# EAGLE schematic mobo-dual-boards (EAGLE 6.6.0)
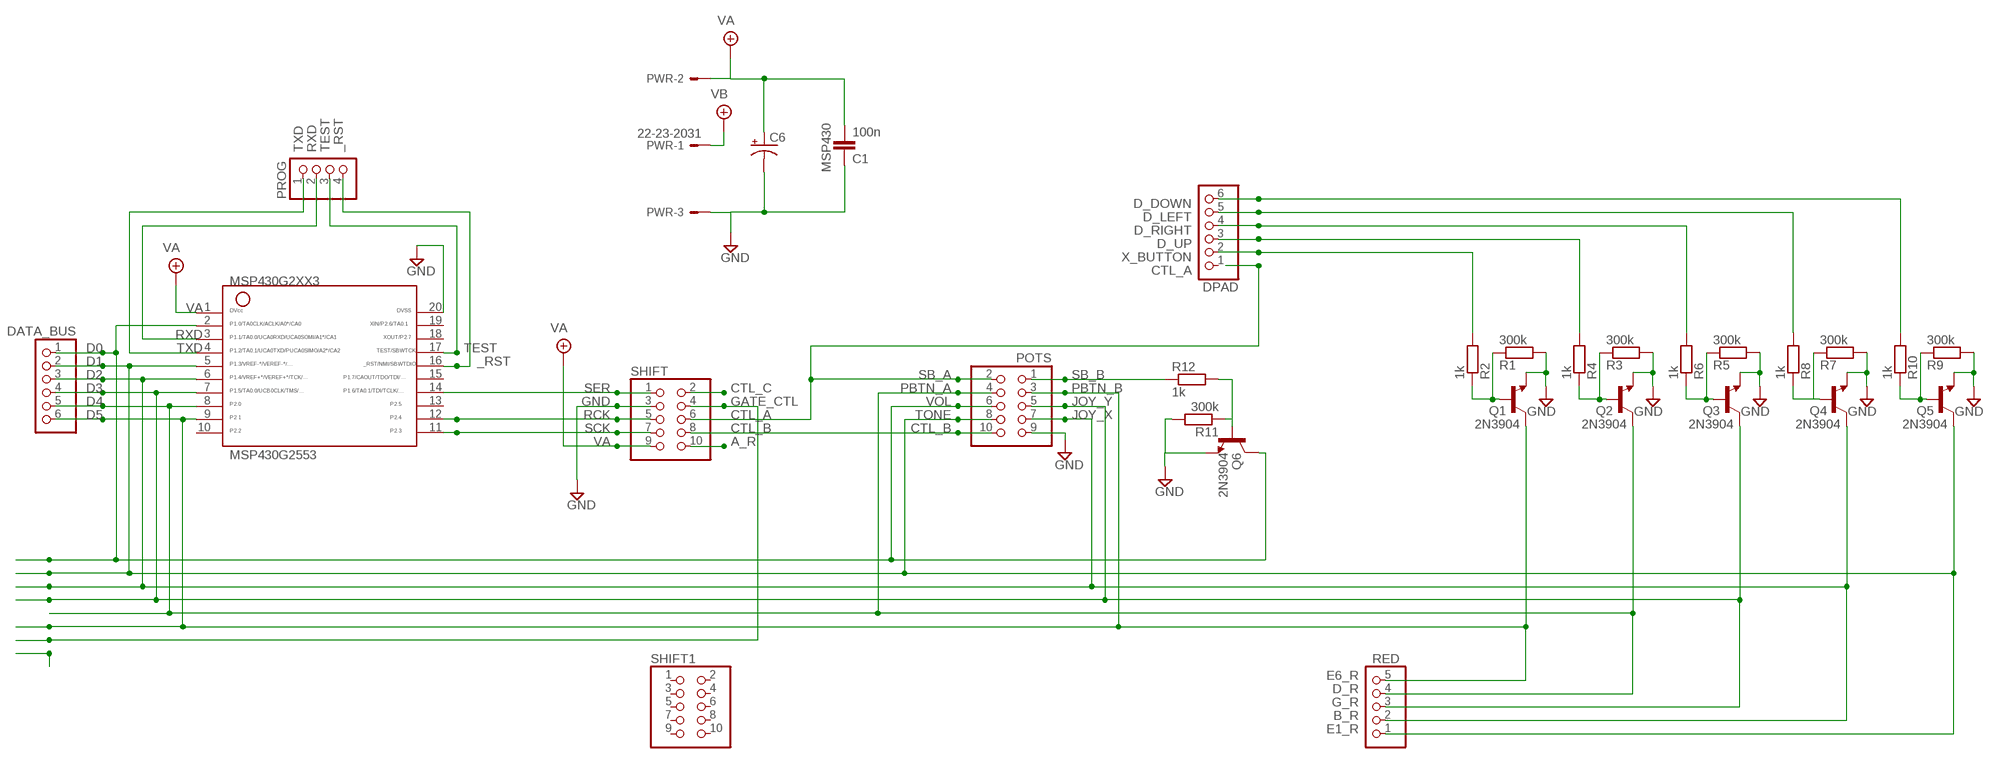
[diagram p0: schematic, sheet 1]

## Parts
C1  100n  050X030_050  [050X030_050_3]
C6  0501  [050_020_1]
DATA_BUS  PINHD-1X6  [1X06]
DPAD  PINHD-1X6  [1X06]
MSP430G2553  G2XX3---N20  [N20]
POTS  PINHD-2X5  [2X05]
PROG  PINHD-1X4  [1X04]
PWR  22-23-2031  [22-23-2031]
Q1  2N3904  [TO92-]
Q2  2N3904  [TO92-]
Q3  2N3904  [TO92-]
Q4  2N3904  [TO92-]
Q5  2N3904  [TO92-]
Q6  2N3904  [TO92-]
R1  300k  6MM-EU1  [R0207/1V]
R2  1k  6MM-EU1  [R0207/1V]
R3  300k  6MM-EU1  [R0207/1V]
R4  1k  6MM-EU1  [R0207/1V]
R5  300k  6MM-EU1  [R0207/1V]
R6  1k  6MM-EU1  [R0207/1V]
R7  300k  6MM-EU1  [R0207/1V]
R8  1k  6MM-EU1  [R0207/1V]
R9  300k  6MM-EU1  [R0207/1V]
R10  1k  6MM-EU1  [R0207/1V]
R11  300k  6MM-EU1  [R0207/1V]
R12  1k  6MM-EU1  [R0207/1V]
RED  PINHD-1X5  [1X05]
SHIFT  PINHD-2X5  [2X05]
SHIFT1  PINHD-2X5  [2X05]

## Nets
_RST: MSP430G2553.16 PROG.4
CTL_A: POTS.2 SHIFT.6
CTL_B: POTS.10 SHIFT.8
CTL_C: SHIFT.2
D0: DATA_BUS.1 MSP430G2553.2 POTS.6 Q6.1(C) SHIFT.10
D1: DATA_BUS.2 MSP430G2553.5 POTS.8 Q5.1(C) RED.1
D2: DATA_BUS.3 MSP430G2553.6 POTS.7 Q4.1(C) RED.2
D3: DATA_BUS.4 MSP430G2553.7 POTS.5 Q3.1(C) RED.3
D4: DATA_BUS.5 MSP430G2553.8 POTS.4 Q2.1(C) RED.4
D5: DATA_BUS.6 MSP430G2553.9 POTS.3 Q1.1(C) RED.5
D_DOWN: DPAD.6 R10.2
D_LEFT: DPAD.5 R8.2
D_RIGHT: DPAD.4 R6.2
D_UP: DPAD.3 R4.2
GATE_CTL: SHIFT.4
GND: C1.1 C6.- MSP430G2553.20 POTS.9 PWR.3 Q1.3(E) Q2.3(E) Q3.3(E) Q4.3(E) Q5.3(E) Q6.3(E) R1.2 R3.2 R5.2 R7.2 R9.2 R11.2 SHIFT.3
N$1: Q6.2(B) R11.1 R12.2
N$13: Q1.2(B) R1.1 R2.1
N$14: Q2.2(B) R3.1 R4.1
N$15: Q3.2(B) R5.1 R6.1
N$16: Q4.2(B) R7.1 R8.1
N$17: Q5.2(B) R9.1 R10.1
N$27: POTS.1 R12.1
RCK: MSP430G2553.12 SHIFT.5
RXD: MSP430G2553.3 PROG.2
SCK: MSP430G2553.11 SHIFT.7
SER: MSP430G2553.14 SHIFT.1
TEST: MSP430G2553.17 PROG.3
TXD: MSP430G2553.4 PROG.1
VA: C1.2 C6.+ MSP430G2553.1 PWR.2 SHIFT.9
VB: PWR.1
X_BUTTON: DPAD.2 R2.2
Unconnected: DPAD.1 MSP430G2553.10 MSP430G2553.13 MSP430G2553.15 MSP430G2553.18 MSP430G2553.19 SHIFT1.1 SHIFT1.2 SHIFT1.3 SHIFT1.4 SHIFT1.5 SHIFT1.6 SHIFT1.7 SHIFT1.8 SHIFT1.9 SHIFT1.10

## Notes on the sheet
- MSP430
- CTL_A
- SB_A | SB_B
- PBTN_A | PBTN_B
- VOL | JOY_Y
- TONE | JOY_X
- CTL_B
- A_R
- E6_R
- D_R
- G_R
- B_R
- E1_R

## Library data of the parts
C1 = gm-caps-ceramic:050X030_050: 120 - 150pF Xicon Ceramic Disc 5mm lead spacing
C6 = gm-caps-electro-pol:050: 0.22 - 100uF Xicon values at Mouser.com: 10V: 10 - 100uF; 16V: 2.2 - 47uF; 25V: 0.47 - 47uF; 50V: 0.22 - 22uF
DATA_BUS DPAD = pinhead:PINHD-1X6: PIN HEADER
MSP430G2553 = TI_MSP430_v16:G2XX3---N20: MSP430G2XX1 PDIP (N) 20 Pin Package
POTS SHIFT SHIFT1 = pinhead:PINHD-2X5: PIN HEADER
PROG = pinhead:PINHD-1X4: PIN HEADER
PWR = jaapie:22-23-2031: .100" (2.54mm) Center Header - 3 Pin; MF: MOLEX; MPN: 22-23-2031; OC_FARNELL: 1462950; OC_NEWARK: 30C0862
Q1-Q6 = gm-trans:2N3904: NPN Transistor
R1-R12 = gm-resistors:6MM-EU: 6mm Resistors (European schematic symbol) Leads spaced 1-6 holes apart for 0.1" perfboard. Suitable for 1/4 watt resistors.
RED = pinhead:PINHD-1X5: PIN HEADER